# EAGLE schematic 1 (EAGLE 7.2.0)
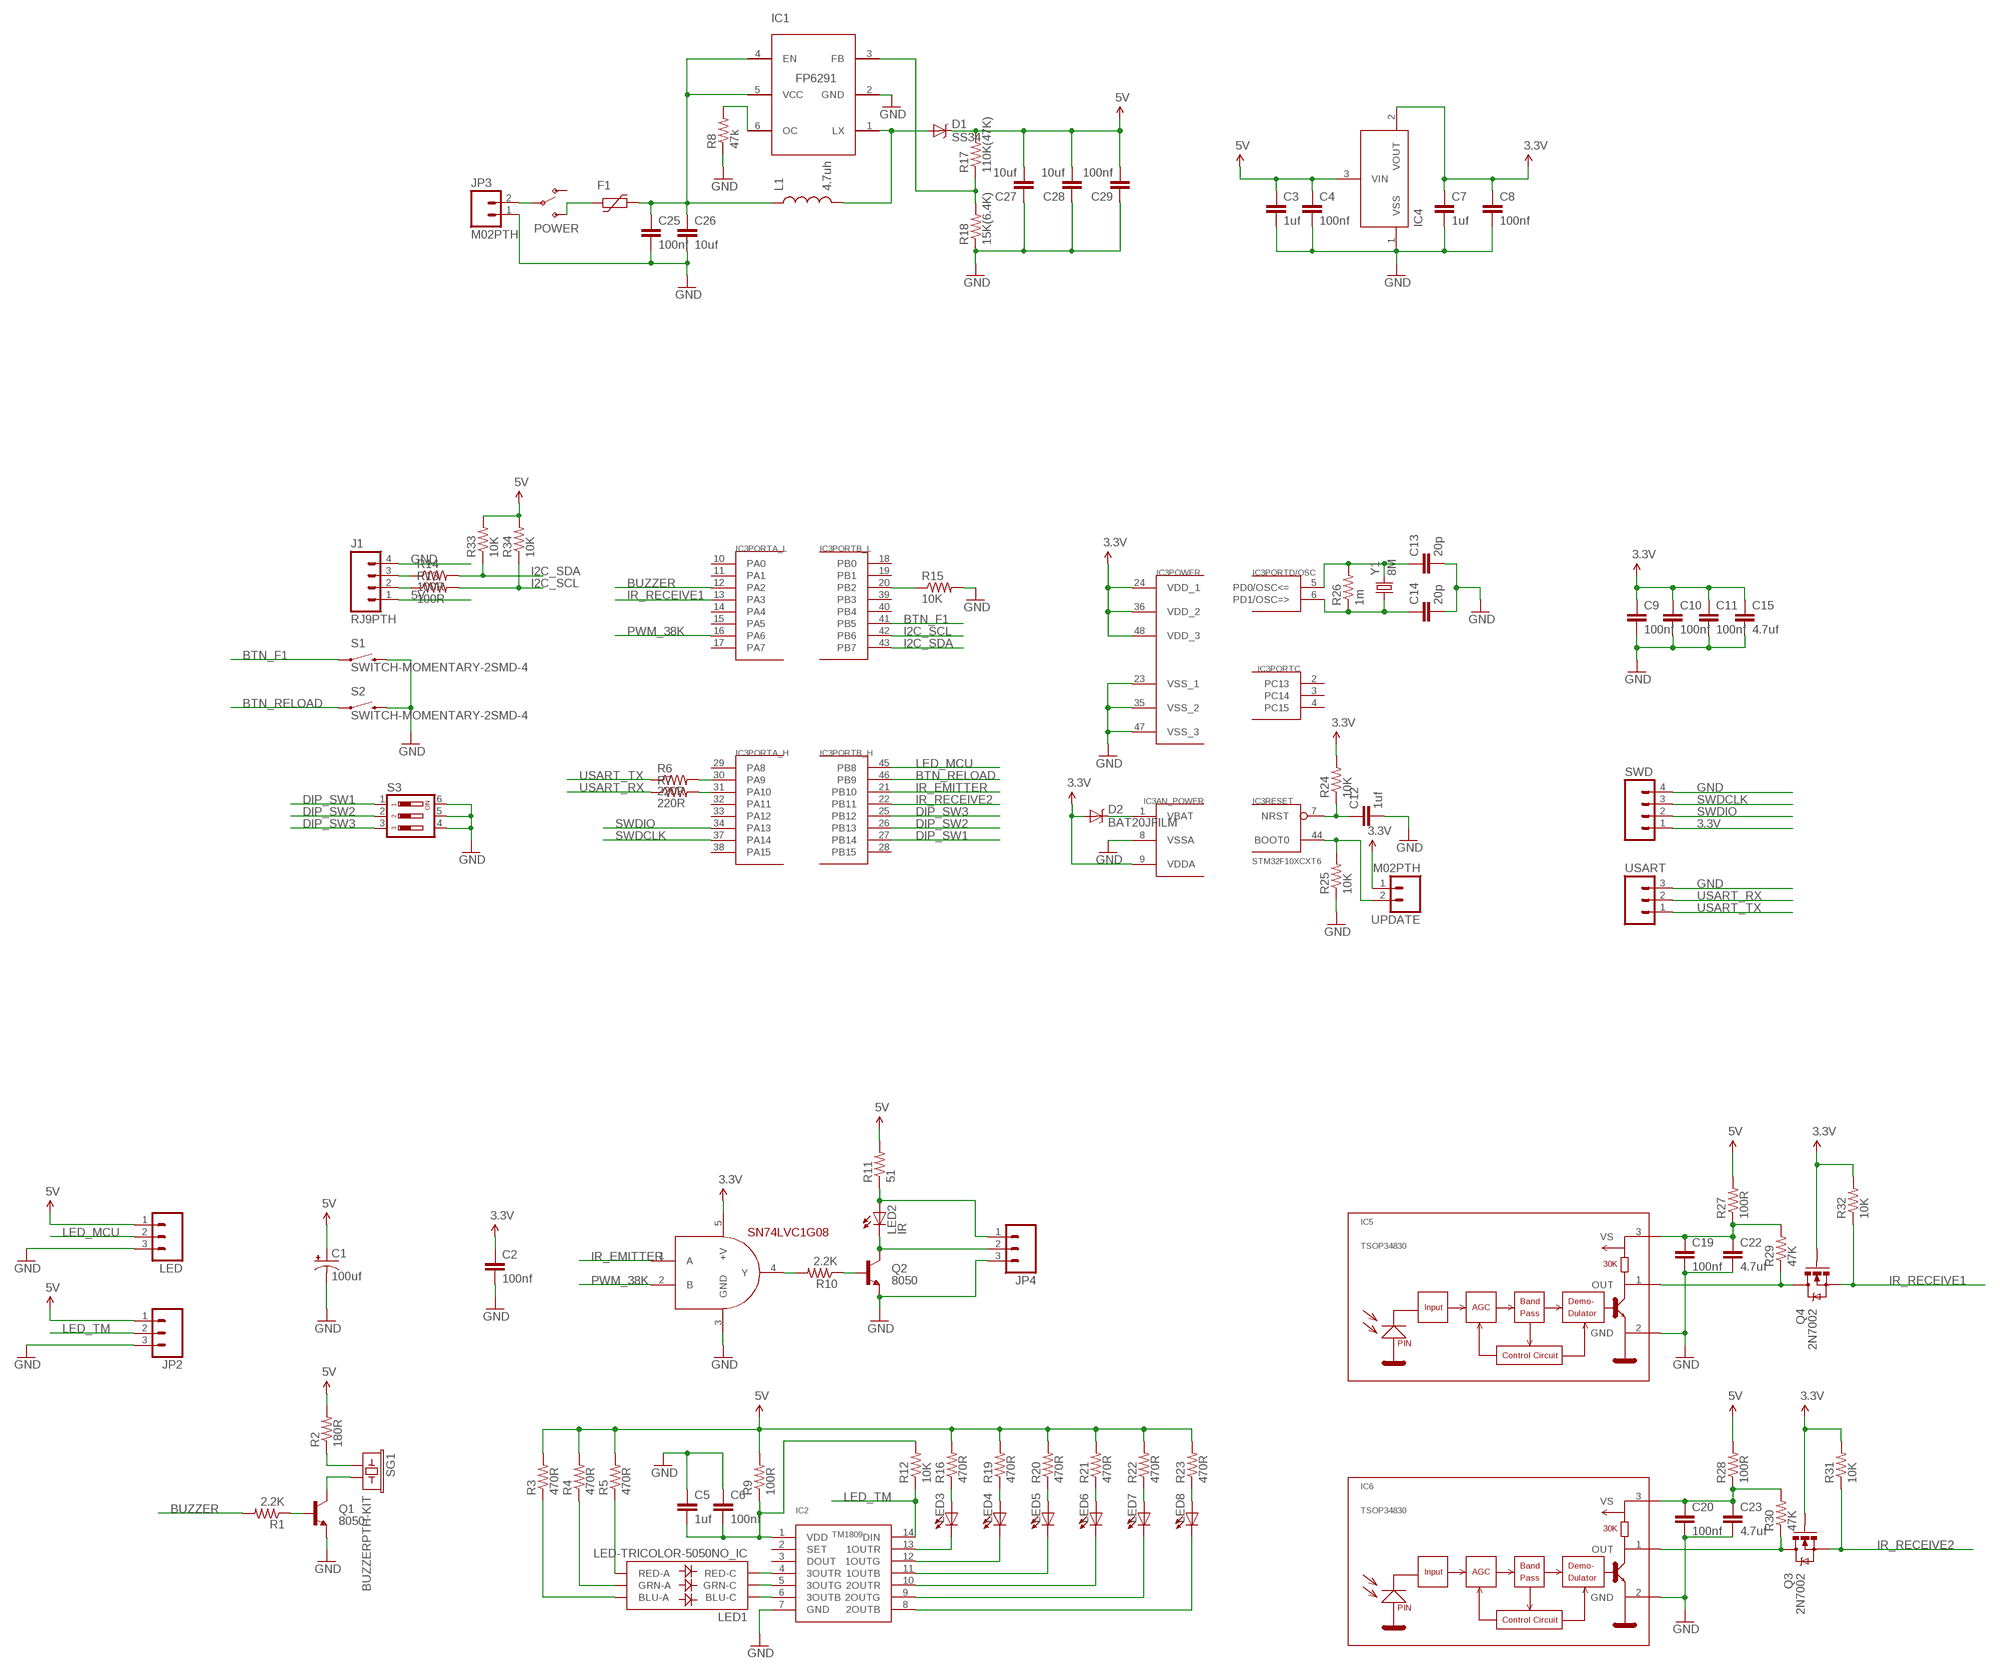
[diagram p0: schematic, sheet 1]

## Parts
C1  100uf  CAP_POL6032  [EIA6032]
C2  100nf  CAP0603-CAP  [0603-CAP]
C3  1uf  CAP0603-CAP  [0603-CAP]
C4  100nf  CAP0603-CAP  [0603-CAP]
C5  1uf  CAP0603-CAP  [0603-CAP]
C6  100nf  CAP0603-CAP  [0603-CAP]
C7  1uf  CAP0603-CAP  [0603-CAP]
C8  100nf  CAP0603-CAP  [0603-CAP]
C9  100nf  CAP0603-CAP  [0603-CAP]
C10  100nf  CAP0603-CAP  [0603-CAP]
C11  100nf  CAP0603-CAP  [0603-CAP]
C12  1uf  CAP0603-CAP  [0603-CAP]
C13  20p  CAP0603-CAP  [0603-CAP]
C14  20p  CAP0603-CAP  [0603-CAP]
C15  4.7uf  CAP0603-CAP  [0603-CAP]
C19  100nf  CAP0603-CAP  [0603-CAP]
C20  100nf  CAP0603-CAP  [0603-CAP]
C22  4.7uf  CAP0603-CAP  [0603-CAP]
C23  4.7uf  CAP0603-CAP  [0603-CAP]
C25  100nf  CAP0603-CAP  [0603-CAP]
C26  10uf  CAP0603-CAP  [0603-CAP]
C27  10uf  CAP0603-CAP  [0603-CAP]
C28  10uf  CAP0603-CAP  [0603-CAP]
C29  100nf  CAP0603-CAP  [0603-CAP]
D1  SS34  DIODE-SCHOTTKY_  [SMA-DIODE]
D2  BAT20JFILM  [SOD-323]
F1  PTC-FUSE  [R0805]
IC1  FP6291  [SOT23-6]
IC2  TM1809  [SOP-14]
IC3  STM32F10XCXT6  [TQFP48]
IC4  XC6206  [SOT23-3]
IC5  TSOP34830  [TSOP348]
IC6  TSOP34830  [TSOP348]
J1  RJ9PTH  [RJ9]
JP2  M03PTH  [1X03]
JP3  M02PTH  [1X02]
JP4  M03PTH  [1X03]
L1  4.7uh  INDUCTORCR75_V2  [CR75_V2]
LED  M03PTH  [1X03]
LED1  LED-TRICOLOR-5050NO_IC  [LED-TRICOLOR-5050]
LED2  IR  LED5MM  [LED5MM]
LED3  LED0805  [CHIPLED_0805]
LED4  LED0805  [CHIPLED_0805]
LED5  LED0805  [CHIPLED_0805]
LED6  LED0805  [CHIPLED_0805]
LED7  LED0805  [CHIPLED_0805]
LED8  LED0805  [CHIPLED_0805]
POWER  SWITCH-SPST3AM6  [SWITCH-SPDT-AM#6]
Q1  8050  TRANSISTOR_NPNSOT23  [SOT23]
Q2  8050  TRANSISTOR_NPNSOT23  [SOT23]
Q3  2N7002  MOSFET-NCHANNELBSS138  [SOT23]
Q4  2N7002  MOSFET-NCHANNELBSS138  [SOT23]
R1  2.2K  RESISTOR0603-RES  [0603-RES]
R2  180R  RESISTOR0603-RES  [0603-RES]
R3  470R  RESISTOR0603-RES  [0603-RES]
R4  470R  RESISTOR0603-RES  [0603-RES]
R5  470R  RESISTOR0603-RES  [0603-RES]
R6  220R  RESISTOR0603-RES  [0603-RES]
R7  220R  RESISTOR0603-RES  [0603-RES]
R8  47k  RESISTOR0603-RES  [0603-RES]
R9  100R  RESISTOR0603-RES  [0603-RES]
R10  2.2K  RESISTOR0603-RES  [0603-RES]
R11  51  RESISTOR1206  [1206]
R12  10K  RESISTOR0603-RES  [0603-RES]
R13  100R  RESISTOR0603-RES  [0603-RES]
R14  100R  RESISTOR0603-RES  [0603-RES]
R15  10K  RESISTOR0603-RES  [0603-RES]
R16  470R  RESISTOR0603-RES  [0603-RES]
R17  110K(47K)  RESISTOR0603-RES  [0603-RES]
R18  15K(6.4K)  RESISTOR0603-RES  [0603-RES]
R19  470R  RESISTOR0603-RES  [0603-RES]
R20  470R  RESISTOR0603-RES  [0603-RES]
R21  470R  RESISTOR0603-RES  [0603-RES]
R22  470R  RESISTOR0603-RES  [0603-RES]
R23  470R  RESISTOR0603-RES  [0603-RES]
R24  10K  RESISTOR0603-RES  [0603-RES]
R25  10K  RESISTOR0603-RES  [0603-RES]
R26  1m  RESISTOR0603-RES  [0603-RES]
R27  100R  RESISTOR0603-RES  [0603-RES]
R28  100R  RESISTOR0603-RES  [0603-RES]
R29  47K  RESISTOR0603-RES  [0603-RES]
R30  47K  RESISTOR0603-RES  [0603-RES]
R31  10K  RESISTOR0603-RES  [0603-RES]
R32  10K  RESISTOR0603-RES  [0603-RES]
R33  10K  RESISTOR0603-RES  [0603-RES]
R34  10K  RESISTOR0603-RES  [0603-RES]
S1  SWITCH-MOMENTARY-2SMD-4  [TACTILE_SWITCH_TALL]
S2  SWITCH-MOMENTARY-2SMD-4  [TACTILE_SWITCH_TALL]
S3  DIP03YL  [DIP03YL]
SG1  BUZZERPTH-KIT  [BUZZER-12MM-KIT]
SWD  M04PTH  [1X04]
U$1  SN74LVC1G08  [SOT23-5]
UPDATE  M02PTH  [1X02]
USART  M03PTH  [1X03]
Y1  8M  CRYSTALTXC-7A  [CRYSTAL-TXC-7A]

## Nets
3.3V: C2.1 C7.1 C8.1 C9.1 C10.1 C11.1 C15.1 D2.2(A) IC3.9(AN_POWER:VDDA) IC3.24(POWER:VDD_1) IC3.36(POWER:VDD_2) IC3.48(POWER:VDD_3) IC4.2(VOUT) Q3.1(G) Q4.1(G) R24.2 R31.2 R32.2 SWD.1 U$1.5(+V) UPDATE.1
5V: C1.P$1(+) C3.1 C4.1 C27.2 C28.2 C29.2 D1.C IC4.3(VIN) J1.1 JP2.1 LED.1 R2.2 R3.2 R4.2 R5.2 R9.2 R11.2 R16.2 R17.2 R19.2 R20.2 R21.2 R22.2 R23.2 R27.2 R28.2 R33.2 R34.2
BTN_F1: IC3.41(PORTB_L:PB5) S1.A2
BTN_RELOAD: IC3.46(PORTB_H:PB9) S2.A2
BUZZER: IC3.12(PORTA_L:PA2) R1.2
DIP_SW1: IC3.27(PORTB_H:PB14) S3.1
DIP_SW2: IC3.26(PORTB_H:PB13) S3.2
DIP_SW3: IC3.25(PORTB_H:PB12) S3.3
GND: C1.P$2(-) C2.2 C3.2 C4.2 C5.1 C6.1 C7.2 C8.2 C9.2 C10.2 C11.2 C12.2 C13.2 C14.2 C15.2 C19.2 C20.2 C22.2 C23.2 C25.2 C26.2 C27.1 C28.1 C29.1 IC1.2(GND) IC2.7(GND) IC3.8(AN_POWER:VSSA) IC3.23(POWER:VSS_1) IC3.35(POWER:VSS_2) IC3.47(POWER:VSS_3) IC4.1(VSS) IC5.2(GND) IC6.2(GND) J1.4 JP2.3 JP3.1 JP4.3 LED.3 Q1.2(E) Q2.2(E) R8.1 R15.2 R18.1 R25.1 S1.B2 S2.B2 S3.4 S3.5 S3.6 SWD.4 U$1.3(GND) USART.3
I2C_SCL: IC3.42(PORTB_L:PB6) R13.2 R34.1
I2C_SDA: IC3.43(PORTB_L:PB7) R14.2 R33.1
IR_EMITTER: IC3.21(PORTB_H:PB10) U$1.1(A)
IR_RECEIVE1: IC3.13(PORTA_L:PA3) Q4.2(S) R32.1
IR_RECEIVE2: IC3.22(PORTB_H:PB11) Q3.2(S) R31.1
LED_MCU: IC3.45(PORTB_H:PB8) LED.2
LED_TM: IC2.14(DIN) JP2.2 R12.1
N$1: IC3.20(PORTB_L:PB2) R15.1
N$2: IC3.44(RESET:BOOT0) R25.2 UPDATE.2
N$3: C13.1 IC3.5(PORTD/OSC:PD0/OSC<=) R26.2 Y1.P$2
N$4: C14.1 IC3.6(PORTD/OSC:PD1/OSC=>) R26.1 Y1.P$1
N$5: D2.1(C) IC3.1(AN_POWER:VBAT)
N$6: R10.2 U$1.4(Y)
N$7: JP3.2 POWER.2(P)
N$8: JP4.2 LED2.K(C) Q2.3(C)
N$9: Q2.1(B) R10.1
N$10: F1.1 POWER.3(S)
N$11: C19.1 C22.1 IC5.3(VS) R27.1 R29.2
N$12: C20.1 C23.1 IC6.3(VS) R28.1 R30.2
N$13: IC2.4(3OUTR) LED1.5(RED-C)
N$14: JP4.1 LED2.A R11.1
N$15: IC2.5(3OUTG) LED1.6(GRN-C)
N$16: IC2.6(3OUTB) LED1.4(BLU-C)
N$17: LED1.2(RED-A) R5.1
N$18: LED1.1(GRN-A) R4.1
N$19: LED1.3(BLU-A) R3.1
N$20: C25.1 C26.1 F1.2 IC1.4(EN) IC1.5(VCC) L1.P$1
N$21: IC2.13(1OUTR) LED3.C
N$22: D1.A IC1.1(LX) L1.P$2
N$23: IC1.6(OC) R8.2
N$24: LED3.A R16.1
N$25: IC1.3(FB) R17.1 R18.2
N$26: LED4.A R19.1
N$27: IC2.12(1OUTG) LED4.C
N$28: IC2.11(1OUTB) LED5.C
N$29: IC2.10(2OUTR) LED6.C
N$30: IC2.9(2OUTG) LED7.C
N$31: IC2.8(2OUTB) LED8.C
N$32: LED5.A R20.1
N$33: LED6.A R21.1
N$34: LED7.A R22.1
N$35: LED8.A R23.1
N$36: C5.2 C6.2 IC2.1(VDD) R9.1 R12.2
N$37: IC3.30(PORTA_H:PA9) R6.2
N$38: IC3.31(PORTA_H:PA10) R7.2
N$39: J1.3 R14.1
N$40: J1.2 R13.1
N$41: R2.1 SG1.+
N$42: Q1.3(C) SG1.-
N$43: Q1.1(B) R1.1
N$44: C12.1 IC3.7(RESET:NRST) R24.1
N$45: IC5.1(OUT) Q4.3(D) R29.1
N$47: IC6.1(OUT) Q3.3(D) R30.1
PWM_38K: IC3.16(PORTA_L:PA6) U$1.2(B)
SWDCLK: IC3.37(PORTA_H:PA14) SWD.3
SWDIO: IC3.34(PORTA_H:PA13) SWD.2
USART_RX: R7.1 USART.2
USART_TX: R6.1 USART.1
Unconnected: IC2.2(SET) IC2.3(DOUT) IC3.2(PORTC:PC13) IC3.3(PORTC:PC14) IC3.4(PORTC:PC15) IC3.10(PORTA_L:PA0) IC3.11(PORTA_L:PA1) IC3.14(PORTA_L:PA4) IC3.15(PORTA_L:PA5) IC3.17(PORTA_L:PA7) IC3.18(PORTB_L:PB0) IC3.19(PORTB_L:PB1) IC3.28(PORTB_H:PB15) IC3.29(PORTA_H:PA8) IC3.32(PORTA_H:PA11) IC3.33(PORTA_H:PA12) IC3.38(PORTA_H:PA15) IC3.39(PORTB_L:PB3) IC3.40(PORTB_L:PB4) POWER.1(O)

## Library data of the parts
C1 = SparkFun-Capacitors:CAP_POL: Capacitor Polarized These are standard SMD and PTH capacitors. Normally 10uF, 47uF, and 100uF in electrolytic and tantalum varieties. Always verify the external diameter of the through hole cap, it varies with capacity, voltage, and manufacturer. The EIA devices should be standard.
C2-C15 C19 C20 C22 C23 C25-C29 = SparkFun-Passives:CAP: Capacitor Standard 0603 ceramic capacitor, and 0.1" leaded capacitor.
D1 = SparkFun-DiscreteSemi:DIODE-SCHOTTKY: Commonly MBRA140.
D2 = SparkFun-DiscreteSemi:BAT20JFILM: 23V, 1A Schottky diode, SOD-323 package; PROD_ID: DIO-11623
F1 = digital-toy:PTC-FUSE
IC1 = eagle_lib_lishen:FP6291
IC2 = eagle_lib_lishen:TM1809
IC3 = stm32:STM32F10XCXT6: ST STM32F101/103 48pin LQFP
IC4 = SparkFun-PowerIC:XC6206: Low ESR Cap. Compatible Positive Voltage Regulator
IC5 IC6 = vishay-1:TSOP348*: IR Receiver Modules for Remote Control Systems http://www.vishay.com/ir-receiver-modules/
J1 = SparkFun-Connectors:RJ9: RJ9 connector (e.g., phone handsets)
JP2 JP4 LED USART = SparkFun-Connectors:M03: Header 3 Standard 3-pin 0.1" header. Use with straight break away headers (SKU : PRT-00116), right angle break away headers (PRT-00553), swiss pins (PRT-00743), machine pins (PRT-00117), and female headers (PRT-00115). Molex polarized connector foot print use with SKU : PRT-08232 with associated crimp pins and housings.
JP3 UPDATE = SparkFun-Connectors:M02: Standard 2-pin 0.1" header. Use with - straight break away headers ( PRT-00116) - right angle break away headers (PRT-00553) - swiss pins (PRT-00743) - machine pins (PRT-00117) - female headers (PRT-00115) Molex polarized connector foot print use with: PRT-08233 with associated crimp pins and housings. 2.54_SCREWTERM for use with PRT-10571. 3.5mm Screw Terminal footprints for PRT-08084 5mm Screw Terminal footprints for use with PRT-08433
L1 = SparkFun-Passives:INDUCTOR: Inductors Basic Inductor/Choke - 0603 and 1206. Footprints are not proven and vary greatly between part numbers. SRN6045- 33uH, 20% 1.4A SDR0403-560KL - 56uH, 10%, 500mA RMS/740mA peak
LED1 = SparkFun-LED:LED-TRICOLOR-5050
LED2 = SparkFun-LED:LED: LEDs
LED3-LED8 = digital-toy:LED: LEDs
POWER = digital-toy:SWITCH-SPST: SPST Switch Simple slide switch. Spark Fun Electronics SKU : COM-00102
Q1 Q2 = SparkFun-DiscreteSemi:TRANSISTOR_NPN: Generic NPN BJT MMBT2222A - TRANS-08049 (SOT-23, 1A 40V) MPSA42 - TRANS-09116 (SOT-23, 500mA 300V) MMBT5088LT1G - TRANS-11160 (SOT-23, 50 mA 30V)
Q3 Q4 = SparkFun-DiscreteSemi:MOSFET-NCHANNEL: Common NMOSFET Parts MFG P/N Store ID Prod ID FDD8780 TRANS-09984 SI7820DN TRANS-11055 FDS6630A IC-08089 2N7002PW TRANS-11151 FQP30N06L COM-10213 TRANS-10060 BSS123LT1G TRANS-08345 BSS138 TRANS-00830 BS170 2N7000; PROD_ID: TRANS-00830
R1-R10 R12-R34 = SparkFun-Passives:RESISTOR: Resistor Basic schematic elements and footprints for 0603, 1206, and PTH resistors.
R11 = SparkFun-Resistors:RESISTOR: Resistor Basic schematic elements and footprints for 0603, 1206, and PTH resistors.
S1 S2 = SparkFun-Electromechanical:SWITCH-MOMENTARY-2: Various NO switches- pushbuttons, reed, etc
S3 = switch-dil:DIP03YL: DIL/CODE SWITCH; OC_FARNELL: unknown; OC_NEWARK: unknown
SG1 = SparkFun-Electromechanical:BUZZER: Buzzer 12mm Spark Fun Electronics SKU : Comp-Buzzer; PROD_ID: COMP-08253
SWD = SparkFun-Connectors:M04: Header 4 Standard 4-pin 0.1" header. Use with straight break away headers (SKU : PRT-00116), right angle break away headers (PRT-00553), swiss pins (PRT-00743), machine pins (PRT-00117), and female headers (PRT-00115). Molex polarized connector foot print use with SKU : PRT-08231 with associated crimp pins and housings. 1MM SMD Version SKU: PRT-10208
U$1 = SparkFun-DigitalIC:SN74LVC1G08: Single-gate AND logic
Y1 = SparkFun-FreqCtrl:CRYSTAL: Various standard crystals. Proven footprints. Spark Fun Electronics SKU : COM-00534